# EAGLE design MotorController_ROUTE (EAGLE 5.04)
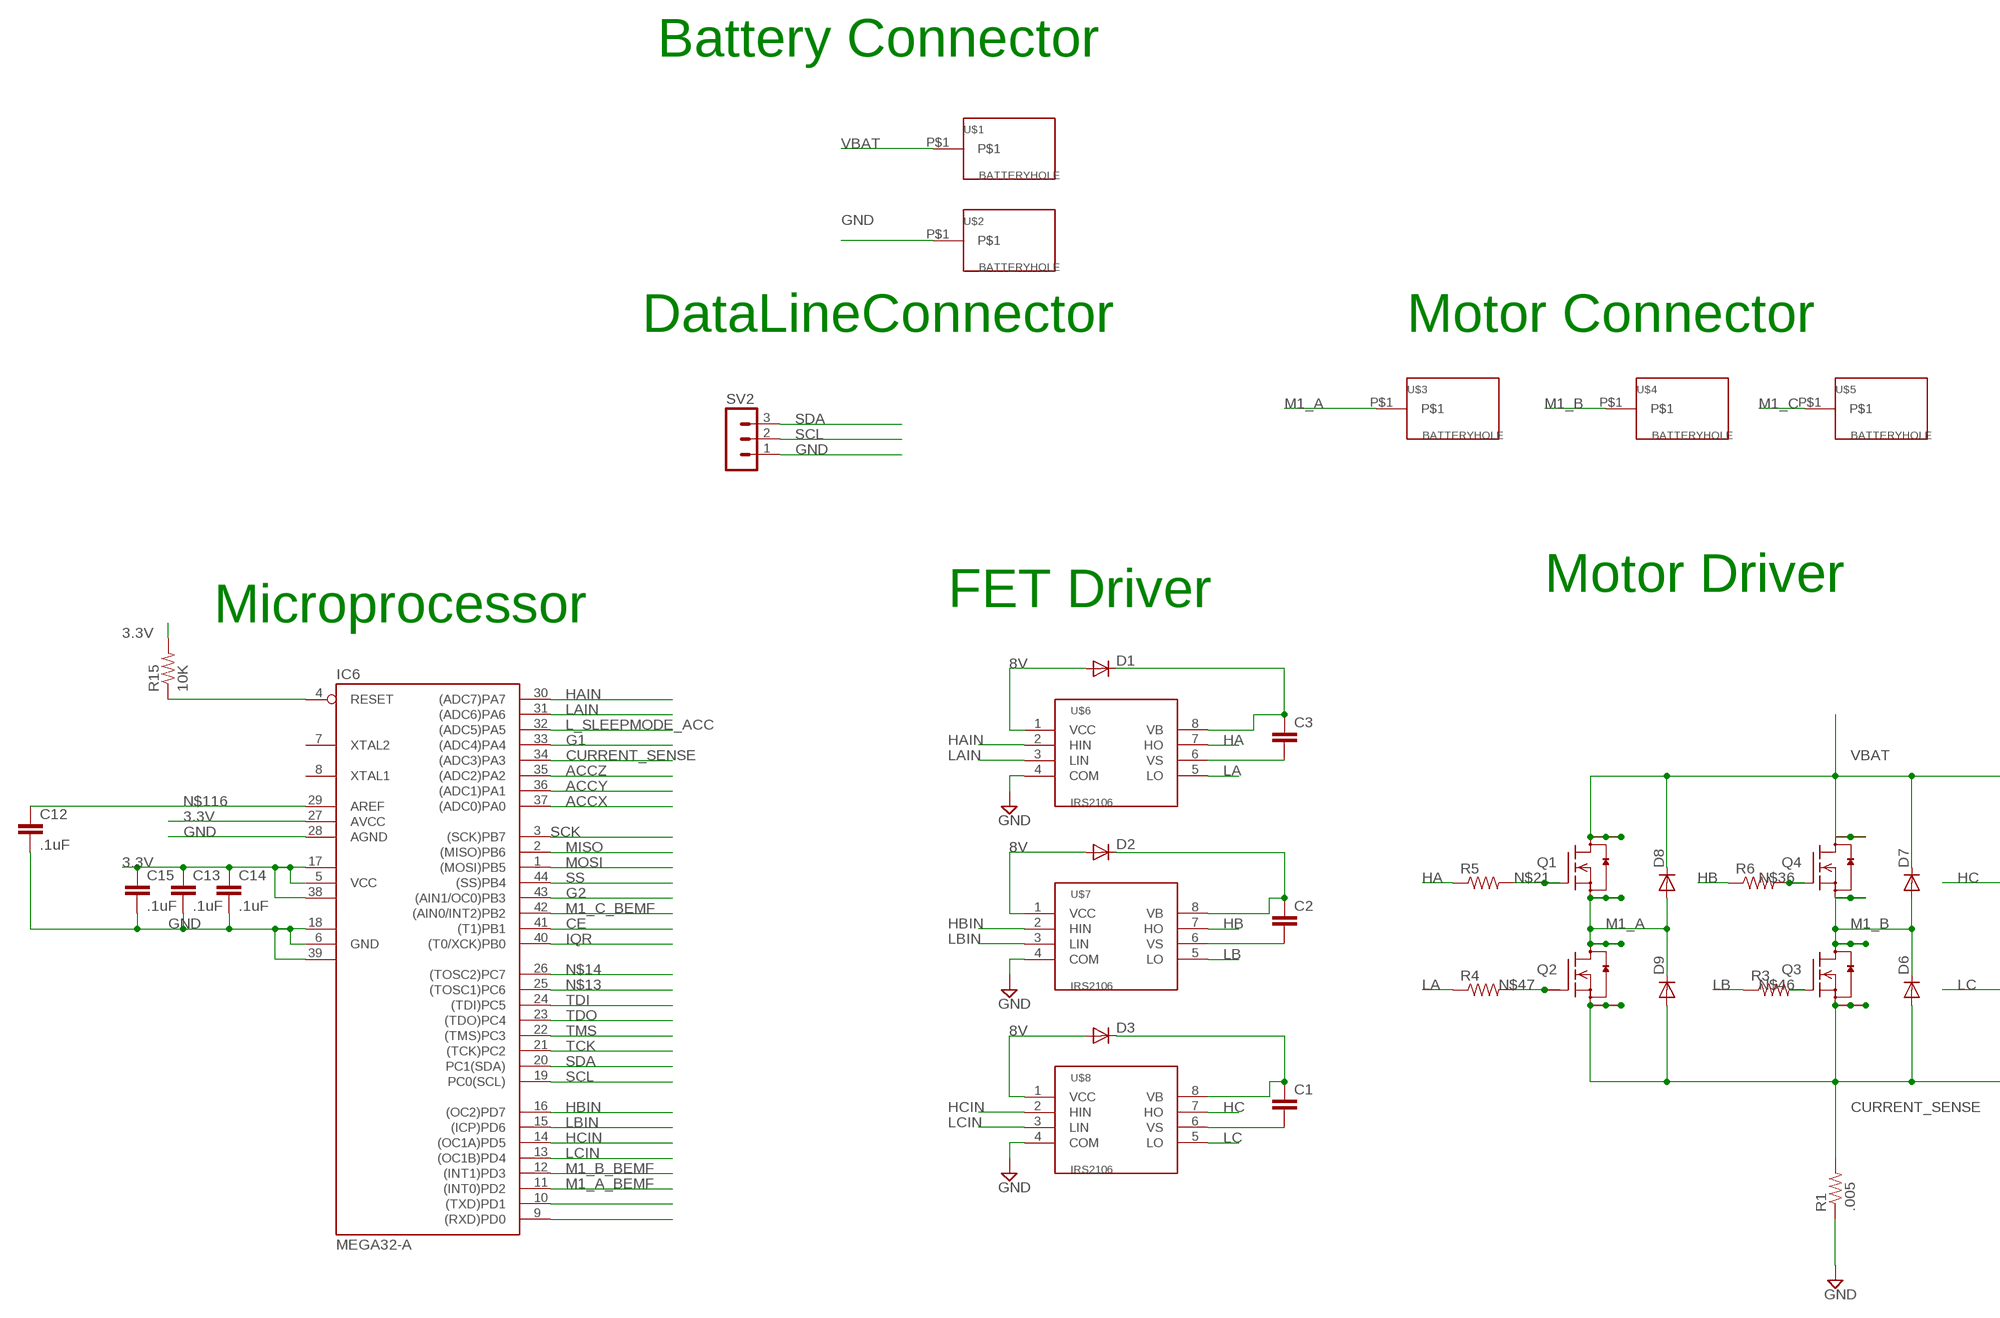
[diagram p0: schematic, sheet 1, part 1 of 2]
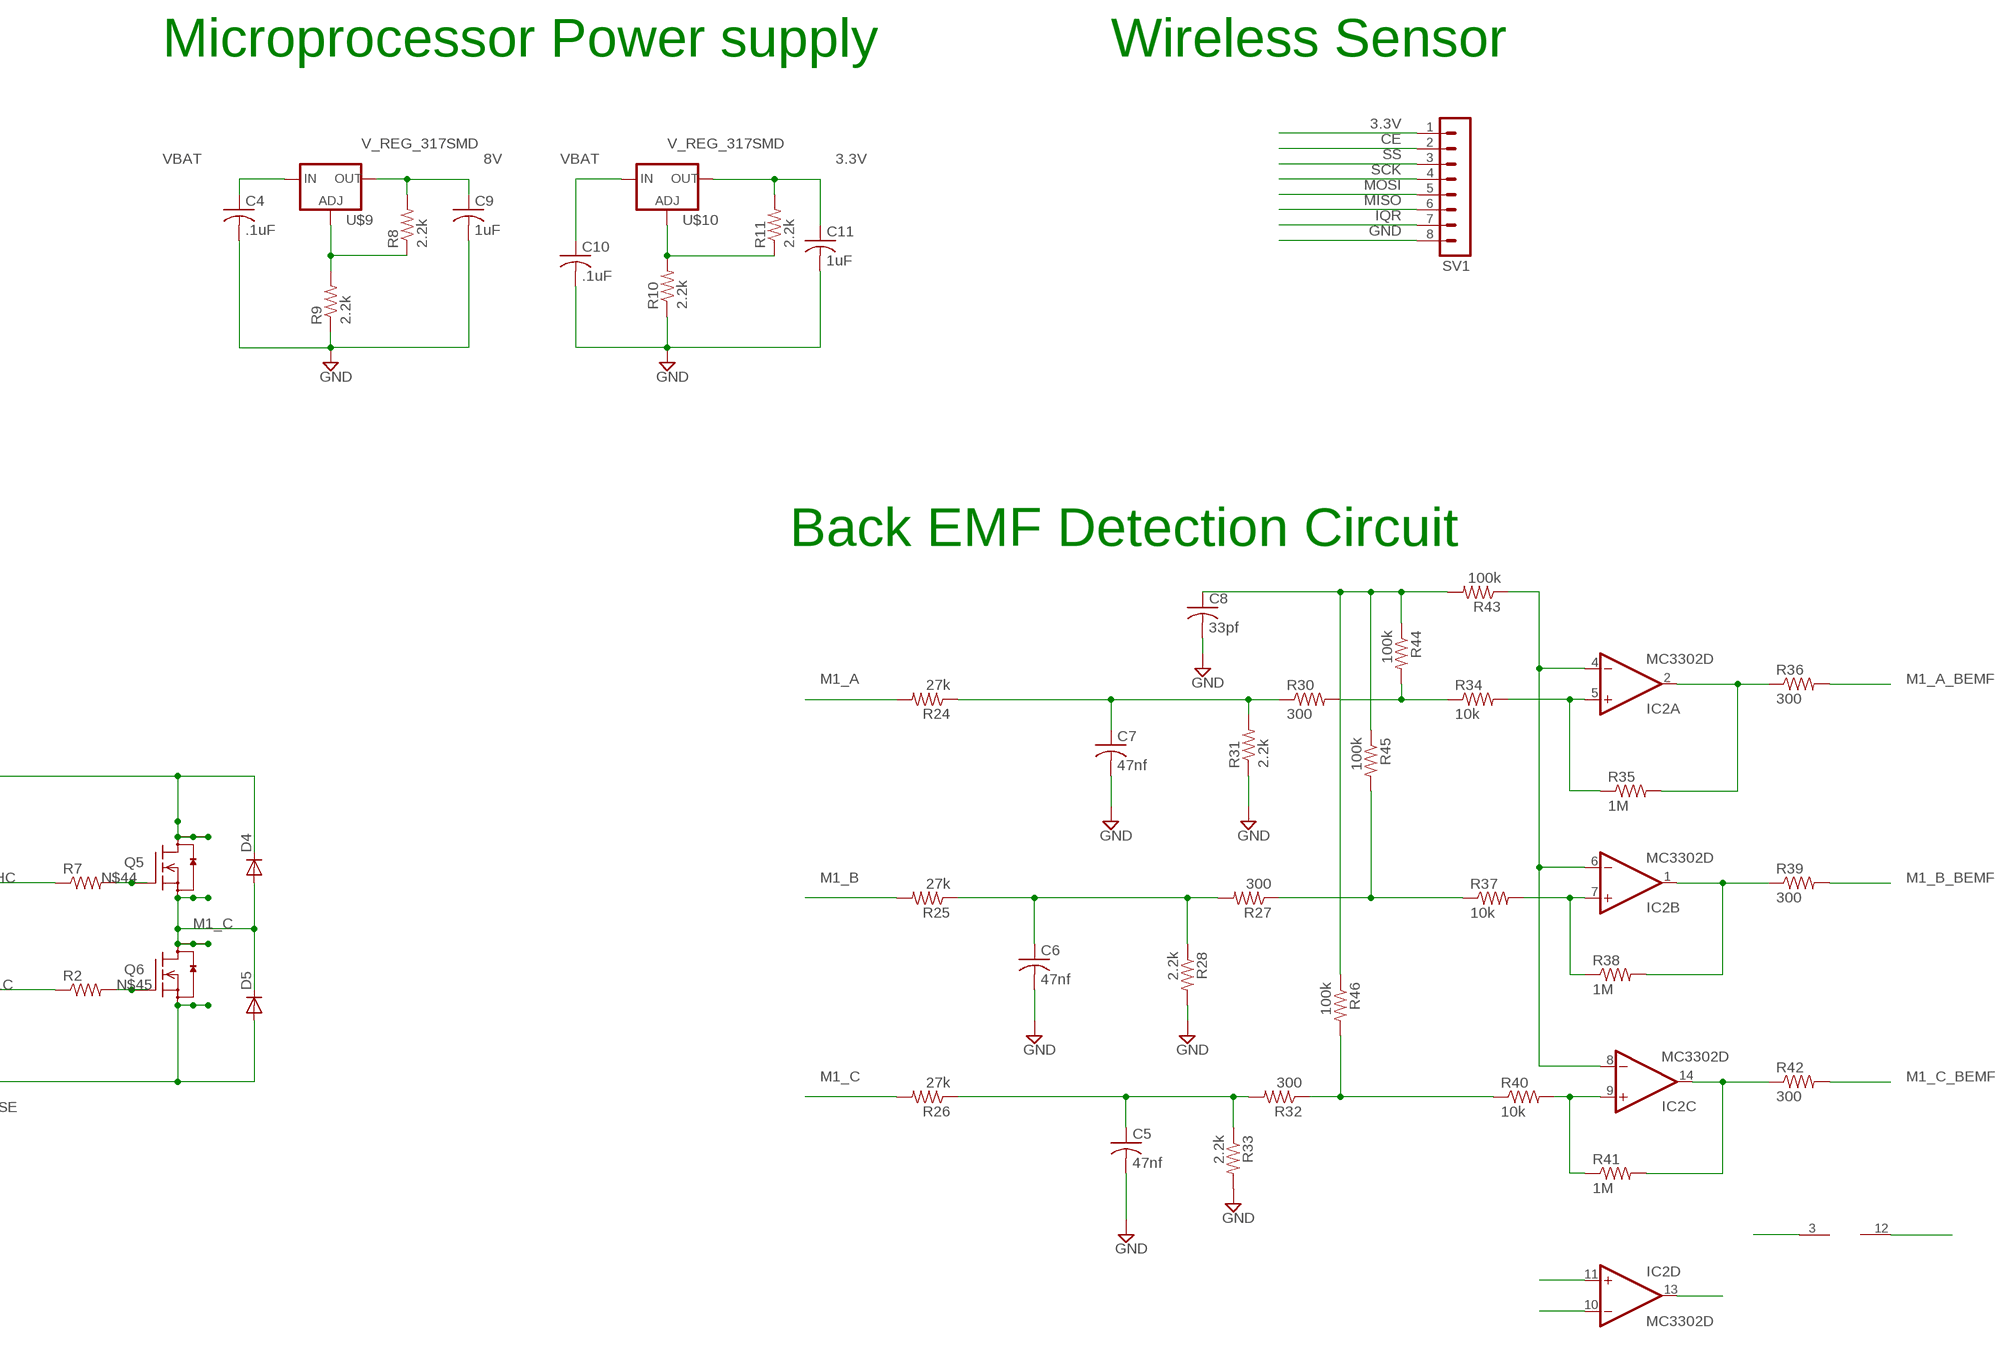
[diagram p1: schematic, sheet 1, part 2 of 2]

## Parts
C1  C-EUC0805  [C0805]
C2  C-EUC0805  [C0805]
C3  C-EUC0805  [C0805]
C4  .1uF  C-USC1206  [C1206@1]
C5  47nf  C-USC0603  [C0603@1]
C6  47nf  C-USC0603  [C0603@1]
C7  47nf  C-USC0603  [C0603@1]
C8  33pf  C-USC0603  [C0603@1]
C9  1uF  C-USC1206  [C1206@1]
C10  .1uF  C-USC1206  [C1206@1]
C11  1uF  C-USC1206  [C1206@1]
C12  .1uF  C-EUC0402  [C0402]
C13  .1uF  C-EUC0402  [C0402]
C14  .1uF  C-EUC0402  [C0402]
C15  .1uF  C-EUC0402  [C0402]
D1  DIODE-DO214AA  [DO214AA]
D2  DIODE-DO214AA  [DO214AA]
D3  DIODE-DO214AA  [DO214AA]
D4  DIODE-DO214AA  [DO214AA]
D5  DIODE-DO214AA  [DO214AA]
D6  DIODE-DO214AA  [DO214AA]
D7  DIODE-DO214AA  [DO214AA]
D8  DIODE-DO214AA  [DO214AA]
D9  DIODE-DO214AA  [DO214AA]
IC2  MC3302D  [SO14]
IC6  MEGA32-A  [TQFP44]
Q1  SI7868ADP  [SO-8-POWERPAK]
Q2  SI7868ADP  [SO-8-POWERPAK]
Q3  SI7868ADP  [SO-8-POWERPAK]
Q4  SI7868ADP  [SO-8-POWERPAK]
Q5  SI7868ADP  [SO-8-POWERPAK]
Q6  SI7868ADP  [SO-8-POWERPAK]
R1  .005  R-US_R2512  [R2512]
R2  R-US_R1206  [R1206]
R3  R-US_R1206  [R1206]
R4  R-US_R1206  [R1206]
R5  R-US_R1206  [R1206]
R6  R-US_R1206  [R1206]
R7  R-US_R1206  [R1206]
R8  2.2k  R-US_R0603  [R0603]
R9  2.2k  R-US_R0603  [R0603]
R10  2.2k  R-US_R0603  [R0603]
R11  2.2k  R-US_R0603  [R0603]
R15  10K  R-US_R0402  [R0402]
R24  27k  R-US_R0603  [R0603]
R25  27k  R-US_R0603  [R0603]
R26  27k  R-US_R0603  [R0603]
R27  300  R-US_R0603  [R0603]
R28  2.2k  R-US_R0603  [R0603]
R30  300  R-US_R0603  [R0603]
R31  2.2k  R-US_R0603  [R0603]
R32  300  R-US_R0603  [R0603]
R33  2.2k  R-US_R0603  [R0603]
R34  10k  R-US_R0603  [R0603]
R35  1M  R-US_R0603  [R0603]
R36  300  R-US_R0603  [R0603]
R37  10k  R-US_R0603  [R0603]
R38  1M  R-US_R0603  [R0603]
R39  300  R-US_R0603  [R0603]
R40  10k  R-US_R0603  [R0603]
R41  1M  R-US_R0603  [R0603]
R42  300  R-US_R0603  [R0603]
R43  100k  R-US_R0603  [R0603]
R44  100k  R-US_R0603  [R0603]
R45  100k  R-US_R0603  [R0603]
R46  100k  R-US_R0603  [R0603]
SV1  MA08-1  [MA08-1]
SV2  MA03-1  [MA03-1]
U$1  BATTERYHOLE  [BATTERYHOLE]
U$2  BATTERYHOLE  [BATTERYHOLE]
U$3  BATTERYHOLE  [BATTERYHOLE]
U$4  BATTERYHOLE  [BATTERYHOLE]
U$5  BATTERYHOLE  [BATTERYHOLE]
U$6  IRS2106  [SOIC8]
U$7  IRS2106  [SOIC8]
U$8  IRS2106  [SOIC8]
U$9  V_REG_317SMD  [SOT223]
U$10  V_REG_317SMD  [SOT223]

## Nets
3.3V: C11.1 C13.1 C14.1 C15.1 IC6.5(VCC) IC6.17(VCC1) IC6.27(AVCC) IC6.38(VCC2) R11.2 R15.2 SV1.1 U$10.2(OUT)
8V: C9.1 D1.A D2.A D3.A R8.2 U$6.1(VCC) U$7.1(VCC) U$8.1(VCC) U$9.2(OUT)
ACCX: IC6.37((ADC0)PA0)
ACCY: IC6.36((ADC1)PA1)
ACCZ: IC6.35((ADC2)PA2)
CE: IC6.41((T1)PB1) SV1.2
CURRENT_SENSE: D5.A D6.A D9.A IC6.34((ADC3)PA3) Q2.1(S) Q2.2(S) Q2.3(S) Q3.1(S) Q3.2(S) Q3.3(S) Q6.1(S) Q6.2(S) Q6.3(S) R1.2
G1: IC6.33((ADC4)PA4)
G2: IC6.43((AIN1/OC0)PB3)
GND: C4.2 C5.2 C6.2 C7.2 C8.2 C9.2 C10.2 C11.2 C12.2 C13.2 C14.2 C15.2 IC6.6(GND) IC6.18(GND1) IC6.28(AGND) IC6.39(GND2) R1.1 R9.1 R10.1 R28.2 R31.1 R33.2 SV1.8 SV2.1 U$2.P$1 U$6.4(COM) U$7.4(COM) U$8.4(COM)
HA: R5.1 U$6.7(HO)
HAIN: IC6.30((ADC7)PA7) U$6.2(HIN)
HB: R6.1 U$7.7(HO)
HBIN: IC6.16((OC2)PD7) U$7.2(HIN)
HC: R7.1 U$8.7(HO)
HCIN: IC6.14((OC1A)PD5) U$8.2(HIN)
IQR: IC6.40((T0/XCK)PB0) SV1.7
L_SLEEPMODE_ACC: IC6.32((ADC5)PA5)
LA: R4.1 U$6.5(LO)
LAIN: IC6.31((ADC6)PA6) U$6.3(LIN)
LB: R3.1 U$7.5(LO)
LBIN: IC6.15((ICP)PD6) U$7.3(LIN)
LC: R2.1 U$8.5(LO)
LCIN: IC6.13((OC1B)PD4) U$8.3(LIN)
M1_A: D8.A D9.C Q1.1(S) Q1.2(S) Q1.3(S) Q2.6(D) Q2.7(D) Q2.8(D) R24.2 U$3.P$1
M1_A_BEMF: IC6.11((INT0)PD2) R36.2
M1_B: D6.C D7.A Q3.6(D) Q3.7(D) Q3.8(D) Q4.1(S) Q4.2(S) Q4.3(S) R25.2 U$4.P$1
M1_B_BEMF: IC6.12((INT1)PD3) R39.2
M1_C: D4.A D5.C Q5.1(S) Q5.2(S) Q5.3(S) Q6.6(D) Q6.7(D) Q6.8(D) R26.2 U$5.P$1
M1_C_BEMF: IC6.42((AIN0/INT2)PB2) R42.2
MISO: IC6.2((MISO)PB6) SV1.6
MOSI: IC6.1((MOSI)PB5) SV1.5
N$1: C3.1 D1.C U$6.8(VB)
N$2: C3.2 U$6.6(VS)
N$3: IC2.3(P:V+)
N$4: IC2.12(P:V-)
N$5: C1.2 U$8.6(VS)
N$6: C6.1 R25.1 R27.2 R28.1
N$7: C1.1 D3.C U$8.8(VB)
N$8: C2.1 D2.C U$7.8(VB)
N$9: C2.2 U$7.6(VS)
N$10: R8.1 R9.2 U$9.1(ADJ)
N$11: IC2.13(D:OUT)
N$12: IC2.11(D:+IN)
N$13: IC6.25((TOSC1)PC6)
N$14: IC6.26((TOSC2)PC7)
N$15: IC2.10(D:-IN)
N$21: Q1.4(G) R5.2
N$24: C7.1 R24.1 R30.1 R31.2
N$29: R30.2 R34.1 R44.2
N$30: IC2.4(A:-IN) IC2.6(B:-IN) IC2.8(C:-IN) R43.1
N$31: IC2.5(A:+IN) R34.2 R35.1
N$32: R10.2 R11.1 U$10.1(ADJ)
N$33: C8.1 R43.2 R44.1 R45.1 R46.1
N$34: IC2.7(B:+IN) R37.2 R38.1
N$35: R27.1 R37.1 R45.2
N$36: Q4.4(G) R6.2
N$37: IC2.9(C:+IN) R40.2 R41.1
N$38: R32.1 R40.1 R46.2
N$39: C5.1 R26.1 R32.2
N$40: R33.1
N$41: IC2.14(C:OUT) R41.2 R42.1
N$42: IC2.1(B:OUT) R38.2 R39.1
N$43: IC2.2(A:OUT) R35.2 R36.1
N$44: Q5.4(G) R7.2
N$45: Q6.4(G) R2.2
N$46: Q3.4(G) R3.2
N$47: Q2.4(G) R4.2
N$113: IC6.4(RESET) R15.1
N$116: C12.1 IC6.29(AREF)
N$122: IC6.10((TXD)PD1)
N$123: IC6.9((RXD)PD0)
SCK: IC6.3((SCK)PB7) SV1.4
SCL: IC6.19(PC0(SCL)) SV2.2
SDA: IC6.20(PC1(SDA)) SV2.3
SS: IC6.44((SS)PB4) SV1.3
TCK: IC6.21((TCK)PC2)
TDI: IC6.24((TDI)PC5)
TDO: IC6.23((TDO)PC4)
TMS: IC6.22((TMS)PC3)
VBAT: C4.1 C10.1 D4.C D7.C D8.C Q1.6(D) Q1.7(D) Q1.8(D) Q4.6(D) Q4.7(D) Q4.8(D) Q5.6(D) Q5.7(D) Q5.8(D) U$1.P$1 U$9.3(IN) U$10.3(IN)
Unconnected: IC6.7(XTAL2) IC6.8(XTAL1) Q1.5(D) Q2.5(D) Q3.5(D) Q4.5(D) Q5.5(D) Q6.5(D)

## Notes on the sheet
- Battery Connector | Microprocessor Power supply | Wireless Sensor
- DataLineConnector | Motor Connector
- Back EMF Detection Circuit
- FET Driver | Motor Driver
- Microprocessor

## Library data of the parts
C1-C3 C12-C15 = rcl:C-EU: CAPACITOR, European symbol
C4-C11 = rcl:C-US: CAPACITOR, American symbol
D1-D9 = diode:DIODE-: DIODE
IC2 = linear:MC3302: COMPARATOR
IC6 = atmel:MEGA32: MICROCONTROLLER 32 Kbytes FLASH 2 Kbytes SRAM 1 Kbytes EEPROM USART 8-channel 10 bit ADC Source: www.atmel.com .. doc2503.pdf
Q1-Q6 = m-pad-2.1:SI7868ADP: Vishay Siliconix Si7868ADP N-Channel 20-V (D-S) MOSFET FEATURES TrenchFET Power MOSFET Low rDS(on) PWM (Qgd and Rg) Optimized 100% Rg Tested RoHS Compliant APPLICATIONS Low Output Voltage Synchronous Rectifier Please send any comments to: messi@users.sourceforge.net
R1-R11 R15 R24-R28 R30-R46 = rcl:R-US_: RESISTOR, American symbol
SV1 = con-lstb:MA08-1: PIN HEADER
SV2 = con-lstb:MA03-1: PIN HEADER
U$1-U$5 = m-pad-2.1:BATTERYHOLE
U$6-U$8 = m-pad-2.1:IRS2106
U$9 U$10 = SparkFun:V_REG_317: Voltage Regulator Standard LM317 adjustable voltage regulator. AOI (Adjust Output Input). Google 'LM317 Calculator' for easy to use app to get the two resistor values needed. 240/720 for 5V output. 240/390 for 3.3V output. Spark Fun Electronics SKU : COM-00527

## Board
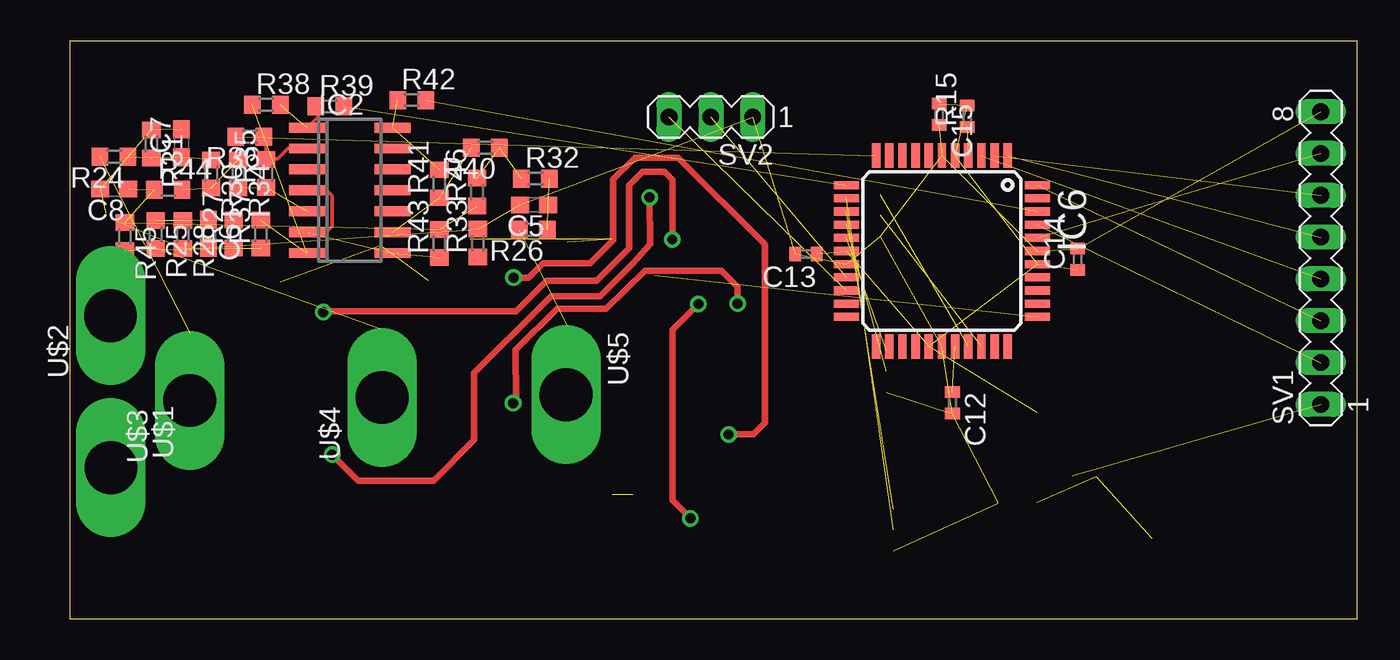
[diagram p2: board, top side]
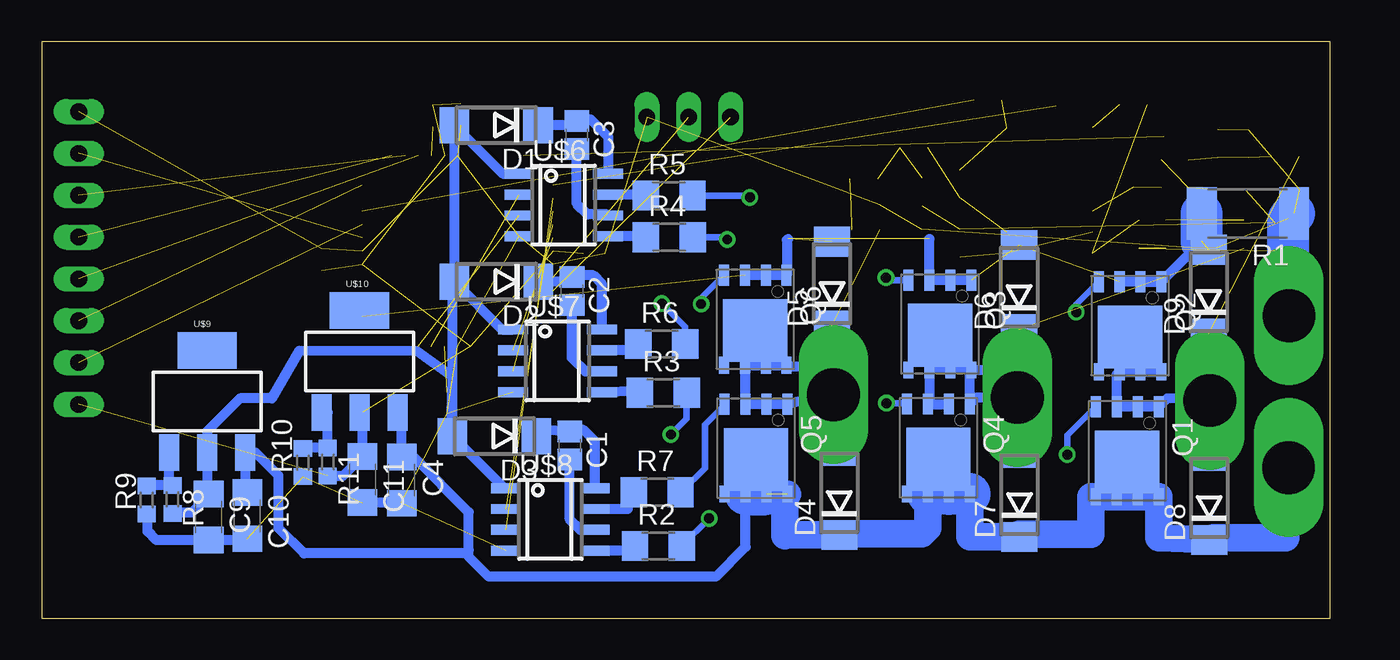
[diagram p3: board, bottom side, seen from below]

Size 78.22 x 35.07 mm. Coordinates in mm from the lower left corner, seen from the top.
Outline: 0,0 78.22,0 78.22,35.07 0,35.07 0,0
Copper layers (1*16): Top 0.035mm / dielectric 1.5mm / Bottom 0.035mm
Design rules "default *": minimum track width 10mil, minimum drill 24mil, track to track 8mil, track to pad 8mil, pad to pad 8mil, via to via 8mil, smd to smd 8mil, copper to edge 10mil, drill to drill 8mil, minimum pad ring 10mil, minimum via ring 8mil, stop-mask expansion 4mil, vias tented up to drill 0mil, thermal gap 10mil

### Footprints (pad centres in the part's own frame; a part is rotated, then mirrored left to right if it is on the bottom)
C0805 = smd 1.3 x 1.5: 1 -0.85,0; 2 0.85,0
C1206@1 = smd 1.6 x 1.8: 1 -1.4,0; 2 1.4,0
C0603@1 = smd 1.1 x 1: 1 -0.85,0; 2 0.85,0
C0402 = smd 0.7 x 0.9: 1 -0.65,0; 2 0.65,0
DO214AA = smd 1.8 x 2.2: A 2.55,0; C -2.55,0
SO14 = smd 0.6 x 2.2: 1 -3.81,-2.6; 2 -2.54,-2.6; 3 -1.27,-2.6; 4 0,-2.6; 5 1.27,-2.6; 6 2.54,-2.6; 7 3.81,-2.6; 8 3.81,2.6; 9 2.54,2.6; 10 1.27,2.6; 11 0,2.6; 12 -1.27,2.6; 13 -2.54,2.6; 14 -3.81,2.6
TQFP44 = smd 1.5 x 0.5: 1 -5.8,4; 2 -5.8,3.2; 3 -5.8,2.4; 4 -5.8,1.6; 5 -5.8,0.8; 6 -5.8,0; 7 -5.8,-0.8; 8 -5.8,-1.6; 9 -5.8,-2.4; 10 -5.8,-3.2; 11 -5.8,-4; 23 5.8,-4; 24 5.8,-3.2; 25 5.8,-2.4; 26 5.8,-1.6; 27 5.8,-0.8; 28 5.8,0; 29 5.8,0.8; 30 5.8,1.6; 31 5.8,2.4; 32 5.8,3.2; 33 5.8,4 | smd 0.5 x 1.5: 12 -4,-5.8; 13 -3.2,-5.8; 14 -2.4,-5.8; 15 -1.6,-5.8; 16 -0.8,-5.8; 17 0,-5.8; 18 0.8,-5.8; 19 1.6,-5.8; 20 2.4,-5.8; 21 3.2,-5.8; 22 4,-5.8; 34 4,5.8; 35 3.2,5.8; 36 2.4,5.8; 37 1.6,5.8; 38 0.8,5.8; 39 0,5.8; 40 -0.8,5.8; 41 -1.6,5.8; 42 -2.4,5.8; 43 -3.2,5.8; 44 -4,5.8
SO-8-POWERPAK = smd 1.27 x 0.61: 1 -2.667,2.54; 2 -2.667,1.27; 3 -2.667,0; 4 -2.667,-1.27 | smd 1.016 x 0.61: 5 2.794,-1.27; 6 2.794,0; 7 2.794,1.27; 8 2.794,2.54 | smd 3.81 x 3.912: P$1 0.686,0.635
R2512 = smd 1.8 x 3.2: 1 -2.8,0; 2 2.8,0
R1206 = smd 1.6 x 1.803: 1 -1.422,0; 2 1.422,0
R0603 = smd 1 x 1.1: 1 -0.85,0; 2 0.85,0
R0402 = smd 0.7 x 0.9: 1 -0.65,0; 2 0.65,0
MA08-1 = drill 1.016 long: 1 -8.89,0; 2 -6.35,0; 3 -3.81,0; 4 -1.27,0; 5 1.27,0; 6 3.81,0; 7 6.35,0; 8 8.89,0
MA03-1 = drill 1.016 long: 1 -2.54,0; 2 0,0; 3 2.54,0
BATTERYHOLE = drill 3.2 long: P$1 0,0
SOIC8 = smd 0.6 x 1.8: 1 -1.905,-2.7; 2 -0.635,-2.7; 3 0.635,-2.7; 4 1.905,-2.7; 5 1.905,2.7; 6 0.635,2.7; 7 -0.635,2.7; 8 -1.905,2.7
SOT223 = smd 1.219 x 2.235: 1 -2.311,-3.099; 2 0,-3.099; 3 2.311,-3.099 | smd 3.6 x 2.2: 4 0,3.099

### Placement (x,y rotation side)
C1  46.18,10.51 270 bottom
C2  46.05,19.9 270 bottom
C3  45.76,29.37 270 bottom
C4  56.39,8.41 270 bottom
C5  28.21,25.13 180 top
C6  8.44,23.36 270 top
C7  6.8,28.87 90 top
C8  2.7,26.08 180 top
C9  68.12,6.17 270 bottom
C10  65.78,6.25 270 bottom
C11  58.78,8.44 270 bottom
C12  53.64,13.1 270 top
C13  44.73,22.15 180 top
C14  61.25,21.82 90 top
C15  52.83,30.63 270 top
D1  50.66,29.97 180 bottom
D2  50.64,20.46 180 bottom
D3  50.76,11.08 180 bottom
D4  29.8,7.63 90 bottom
D5  30.25,20.34 90 bottom
D6  18.88,20.14 90 bottom
D7  18.86,7.51 90 bottom
D8  7.33,7.33 90 bottom
D9  7.36,19.85 90 bottom
IC2  17.03,26.01 270 top
IC6  53,22.33 270 top
Q1  12.94,10.19 270 bottom
Q2  12.77,17.79 270 bottom
Q3  24.32,17.89 270 bottom
Q4  24.42,10.37 270 bottom
Q5  35.5,10.36 270 bottom
Q6  35.54,18.18 270 bottom
R1  4.98,24.61 180 bottom
R2  40.8,4.41 0 bottom
R3  40.5,13.72 0 bottom
R4  40.14,23.16 0 bottom
R5  40.15,25.69 0 bottom
R6  40.59,16.67 0 bottom
R7  40.87,7.67 0 bottom
R8  70.32,7.24 270 bottom
R9  71.88,7.2 90 bottom
R10  62.4,9.47 90 bottom
R11  60.89,9.51 270 bottom
R15  54.53,30.51 90 top
R24  2.7,28.05 180 top
R25  5.22,23.34 270 top
R26  28.17,23.62 180 top
R27  9.98,23.35 90 top
R28  6.88,23.34 270 top
R30  8.59,27.01 270 top
R31  4.97,28.83 270 top
R32  28.3,26.72 0 top
R33  24.8,22.8 90 top
R34  10.24,27 270 top
R35  11.94,27.03 90 top
R36  10.95,29.27 180 top
R37  11.62,23.35 90 top
R38  11.95,31.2 0 top
R39  15.8,31.11 0 top
R40  25.26,28.6 180 top
R41  22.46,26.41 90 top
R42  20.78,31.49 0 top
R43  22.46,22.78 90 top
R44  5.99,26.04 0 top
R45  3.36,23.2 270 top
R46  24.75,25.9 90 top
SV1  76.02,21.9 90 top
SV2  38.96,30.46 180 top
U$1  2.5,9.17 270 top
U$2  2.48,18.4 90 top
U$3  7.29,13.24 90 top
U$4  18.98,13.42 90 top
U$5  30.16,13.6 270 top
U$6  46.56,25.12 270 bottom
U$7  46.93,15.65 270 bottom
U$8  47.36,6.02 270 bottom
U$9  68.21,13.18 0 bottom
U$10  58.96,15.62 0 bottom

### Tracks (layer width: path | path; a pad name or v marks a point on that pad's centre or on a via)
3.3V  (9 unrouted)
  Bottom 0.61: U$10.2 58.78,12.52 C11.1 59.96,8.66 R11.2
8V
  Bottom 0.61: U$6.1 50.26,27.02 D1.A 53.19,29.95 D2.A | U$7.1 50.29,17.56 D2.A | U$8.1 50.16,7.92 D3.A | R8.2 70.27,6.44 69.17,6.44 68.12,7.49 C9.1 68.21,7.66 U$9.2 68.21,11.38 66.22,13.38 64.3,13.38 62.63,16.26 55.47,16.25 53.31,14.68 53.4,11.16 D3.A | D3.A 53.31,20.34 D2.A
CE  (1 unrouted)
CURRENT_SENSE  (6 unrouted)
  Bottom 0.61: 7.78,22.91 Q2.1 Q2.2 Q2.3 | Q3.1 Q3.2 Q3.3 24.32,23.05 24.34,23.06 | 32.92,23.06 32.99,23 32.99,20.87 Q6.1 Q6.2 Q6.3
  Bottom 2.54: 7.78,22.91 R1.2
GND  (23 unrouted)
  Bottom 0.61: R9.1 71.83,6.3 71.83,5.3 71.3,4.77 C9.2 65.86,4.77 C10.2 | C11.2 56.43,7.04 C4.2
  Bottom 2.54: U$2.P$1 2.51,24.28 R1.1
HA
  Bottom 0.61: U$6.7 41.25,25.75 R5.1
HAIN  (1 unrouted)
HB
  Bottom 0.61: U$7.7 41.83,16.29 R6.1
HBIN  (1 unrouted)
HC
  Bottom 0.61: U$8.7 42.66,6.66 R7.1
HCIN  (1 unrouted)
IQR  (1 unrouted)
LA
  Bottom 0.61: U$6.5 41.28,23.21 R4.1
LAIN  (1 unrouted)
LB
  Bottom 0.61: U$7.5 42.13,13.8 R3.1
LBIN  (1 unrouted)
LC
  Bottom 0.61: U$8.5 41.91,4.12 R2.1
LCIN  (1 unrouted)
M1_A  (1 unrouted)
  Bottom 0.61: Q2.8 Q2.7 Q2.6 12.94,14.83 Q1.3 Q1.2 Q1.1 9.88,13.38 U$3.P$1 6.96,12.9 D8.A 6.96,16.9 D9.C
M1_A_BEMF  (1 unrouted)
M1_B  (1 unrouted)
  Bottom 0.61: Q3.8 21.88,15.01 Q4.1 21.49,13.42 U$4.P$1 18.98,10.19 D7.A | Q3.8 Q3.7 Q3.6 24.32,13.12 Q4.3 Q4.2 | D6.C 18.88,16.79 20.55,15.12 21.77,15.12 Q3.8
M1_B_BEMF  (1 unrouted)
M1_C  (1 unrouted)
  Bottom 0.61: D4.A 29.19,12.62 U$5.P$1 32.05,13.23 Q5.1 Q5.2 Q5.3 35.5,15 Q6.6 Q6.7 Q6.8 32.93,15.32 32.1,15.32 30.25,17.17 D5.C
M1_C_BEMF  (1 unrouted)
MISO  (1 unrouted)
MOSI  (1 unrouted)
N$1
  Bottom 0.61: U$6.8 43.84,27.04 43.84,29.25 44.91,30.32 C3.1 46.11,29.97 D1.C
N$2
  Bottom 0.61: C3.2 45.76,25.2 45.1,24.55 43.92,24.55 U$6.6
N$5
  Bottom 0.61: C1.2 46.18,6.02 45.54,5.38 U$8.6
N$6  (3 unrouted)
N$7
  Bottom 0.61: U$8.8 44.66,10.77 45.35,11.46 46.18,11.46 C1.1 47.83,11.46 D3.C
N$8
  Bottom 0.61: U$7.8 44.23,20.31 44.75,20.84 46.04,20.84 C2.1 46.43,20.46 D2.C
N$9
  Bottom 0.61: C2.2 46.05,15.82 45.23,15.01 U$7.6
N$10
  Bottom 0.61: U$9.1 70.52,8.29 R8.1 71.84,8.09 R9.2
N$21  (via drill 0.6)
  Top 0.406: v35.24,25.59 35.26,22.74 34.23,21.58 32.22,19.56 29.25,19.56 28.73,19.07 24.58,14.92 24.58,10.86 22.1,8.38 17.53,8.38 v15.95,9.96
  Bottom 0.406: R5.2 35.34,25.69 v35.24,25.59 | v15.95,9.96 15.95,11.12 Q1.4
N$24  (3 unrouted)
N$29  (2 unrouted)
N$30  (2 unrouted)
  Top 0.203: IC2.4 15.62,26.01 15.94,25.69 15.94,23.84 15.57,23.47 IC2.6
N$31  (2 unrouted)
N$32
  Bottom 0.61: U$10.1 60.89,12.52 R11.1 62.4,10.36 R10.2
N$33  (4 unrouted)
N$34  (2 unrouted)
N$35  (2 unrouted)
N$36  (via drill 0.6)
  Top 0.406: v40.58,19.13 40.58,20.15 39.61,21.12 34.97,21.12 32.6,18.82 29.61,18.82 27.11,16.31 27.13,13.28 v26.94,13.09
  Bottom 0.406: R6.2 39.17,17.71 v40.58,19.13 | v26.94,13.09 25.74,13.09 Q4.4
N$37  (2 unrouted)
N$38  (2 unrouted)
N$39  (2 unrouted)
N$41  (2 unrouted)
N$42  (1 unrouted)
  Top 0.203: R39.1 15.1,30.49 IC2.1
N$43
  Top 0.203: IC2.2 13.28,28.55 12.64,27.92 11.97,27.92 R35.2 11.94,29.23 R36.1
N$44
  Bottom 0.406: Q5.4 36.77,12.97 37.98,11.76 37.98,9.14 R7.2
N$45  (via drill 0.6)
  Top 0.406: v38.2,19.11 36.62,17.53 36.62,7.19 v37.72,6.09
  Bottom 0.406: 39.17,4.19 R2.2 37.72,6.07 v37.72,6.09 | v38.2,19.11 38.2,19.46 Q6.4
N$46  (via drill 0.6)
  Top 0.406: v40.04,11.18 41.55,11.18 42.26,11.89 42.26,22.73 36.98,28 34.34,28 33.02,26.68 33.02,22.98 31.63,21.59 28.76,21.59 27.89,20.71 v26.97,20.71
  Bottom 0.406: R3.2 39.08,12.14 v40.04,11.18 | Q3.4 26.82,20.56 v26.97,20.71
N$47  (via drill 0.6)
  Top 0.406: v36.62,23.02 36.62,26.66 36.15,27.12 34.8,27.12 33.99,26.31 33.99,22.48 32.02,20.51 28.97,20.51 27.11,18.65 15.44,18.65 v15.4,18.61
  Bottom 0.406: R4.2 36.75,23.16 v36.62,23.02 | v15.4,18.61 15.4,19.1 Q2.4
N$113  (1 unrouted)
N$116  (1 unrouted)
SCK  (1 unrouted)
SCL  (1 unrouted)
SDA  (1 unrouted)
SS  (1 unrouted)
VBAT  (1 unrouted)
  Bottom 0.61: U$10.3 56.39,12.52 C4.1 55.66,9.81 52.32,6.47 52.32,4.16 | C10.1 65.9,7.77 U$9.3 65.28,10.08 63.88,8.68 63.88,5.5 62.33,3.96 52.52,3.96 52.32,4.16 | Q5.6 35.5,4.35 37.3,2.55 51.11,2.55 52.32,3.76 52.32,4.16
  Bottom 1.676: U$1.P$1 2.57,9.17 2.69,4.9 7.08,4.9 D8.C 10.4,4.91 Q1.8 Q1.7 Q1.6 14.53,7.4 14.53,5.11 18.86,5.11 D7.C 21.88,4.96 Q4.8 | Q4.6 24.42,5.51 24.78,5.15 29.73,5.15 D4.C 33.08,5.08 33.12,5.05 33.12,7.41 Q5.8
  Bottom 2.54: Q4.8 Q4.7 Q4.6 | Q5.6 Q5.7